# Altium schematic sheet PAGE2 - POWER, RTC, RPI.SchDoc (part 3 of 3)
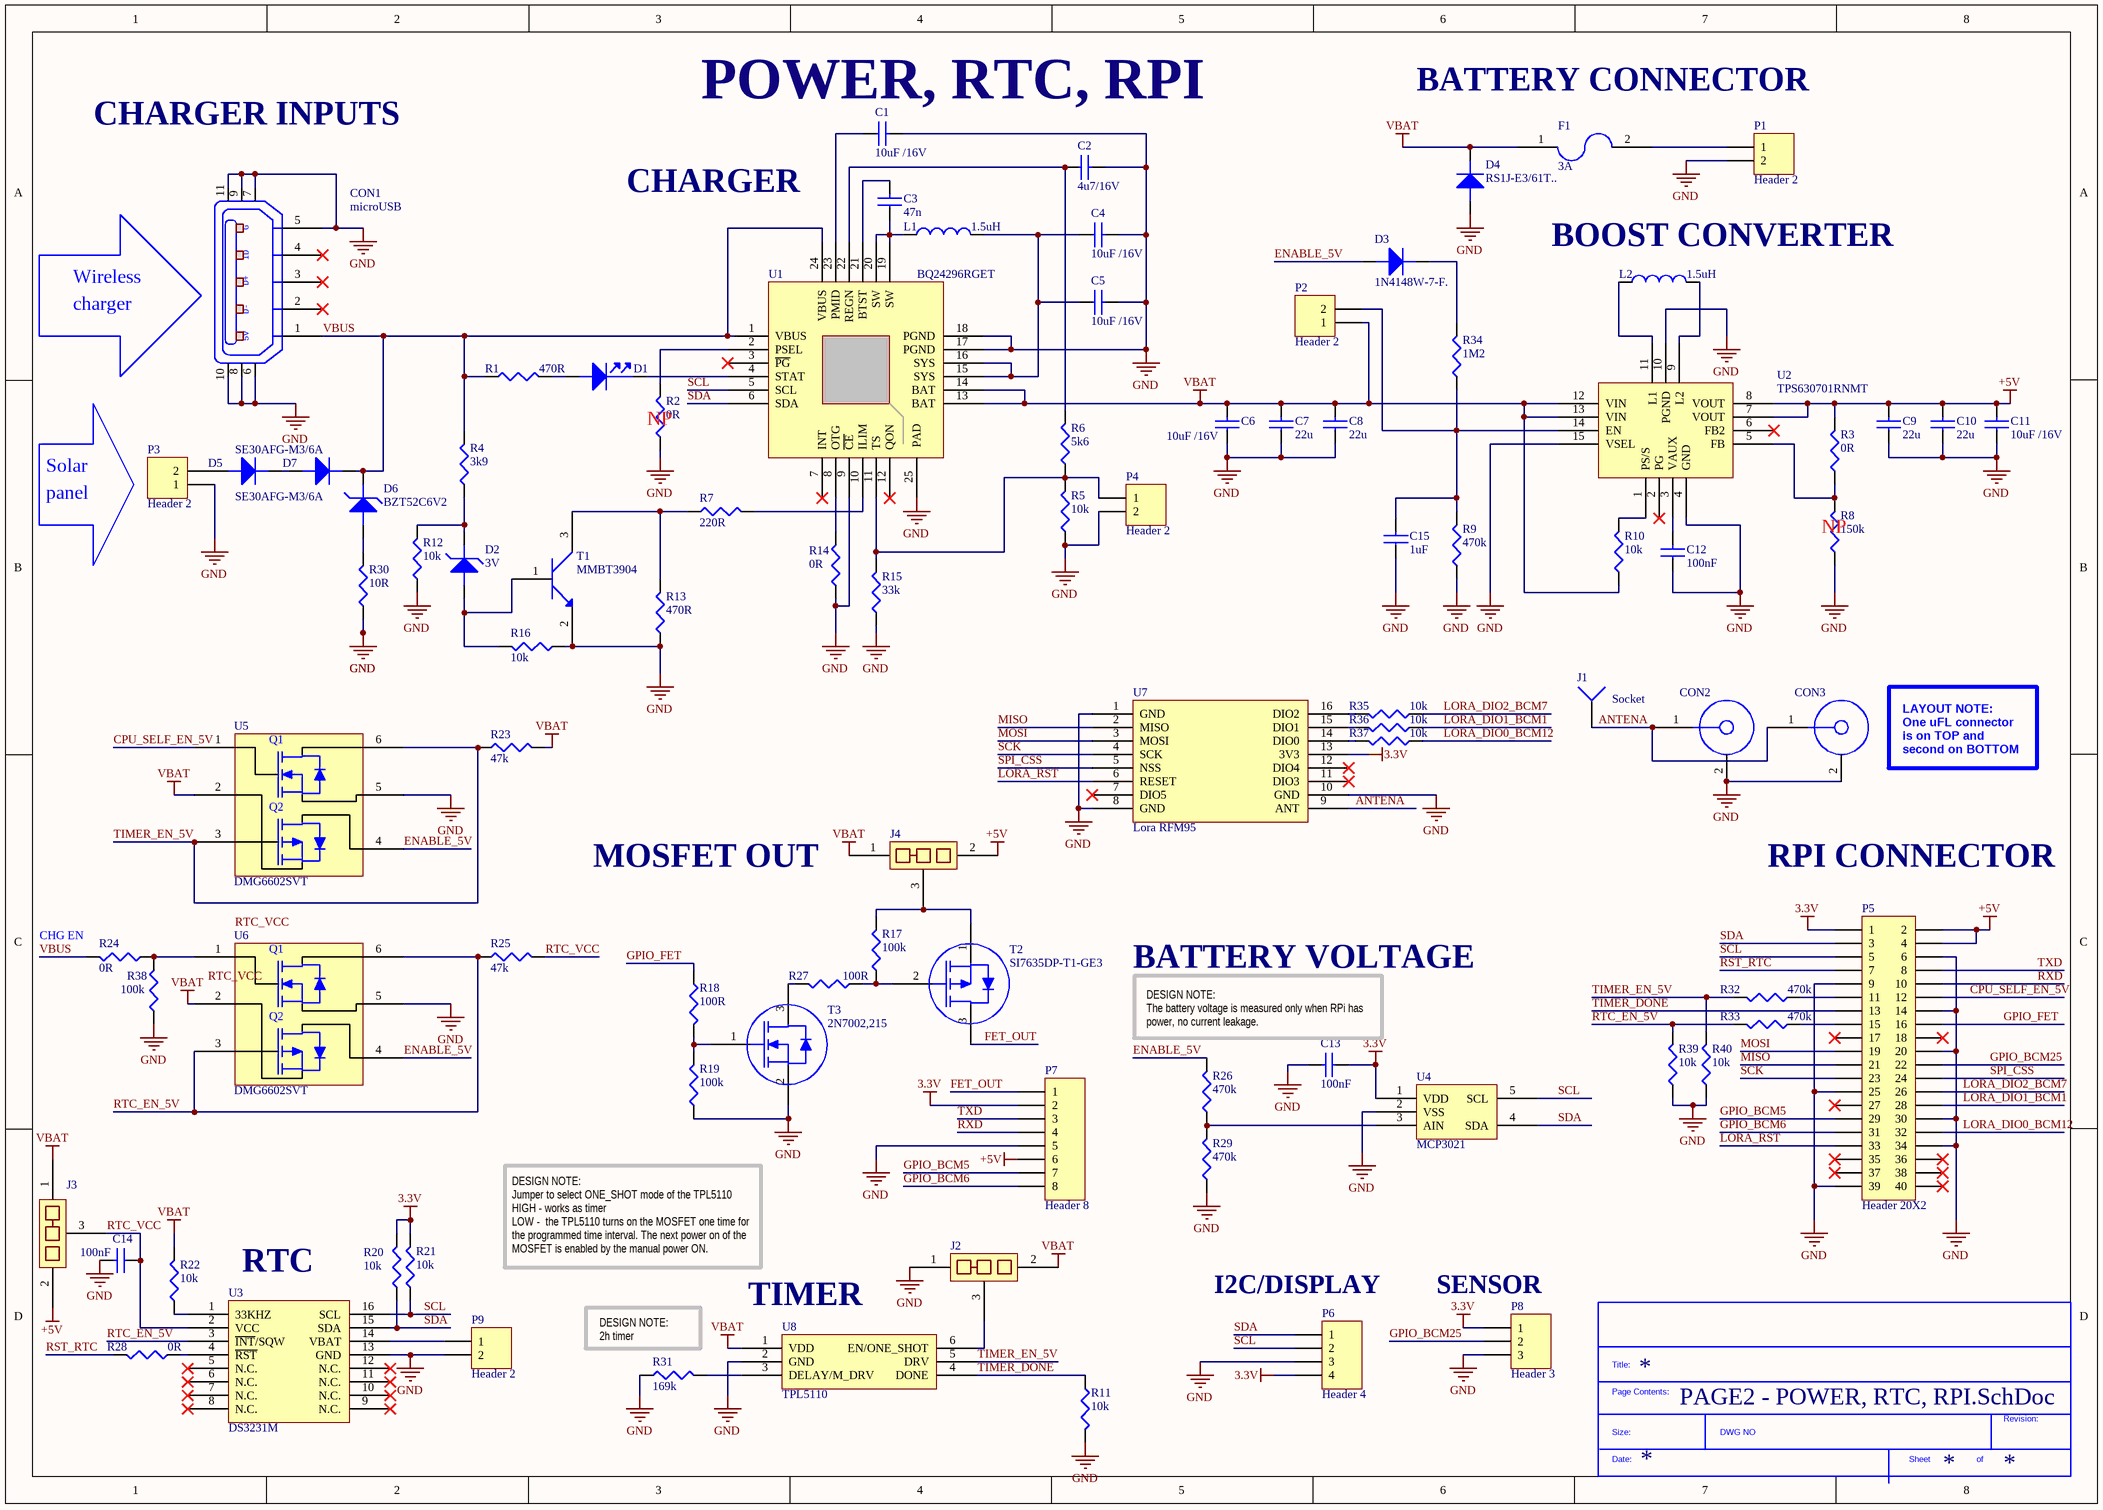
[diagram p2: PAGE2 - POWER, RTC, RPI.SchDoc]

## Library data of the parts (continued)
T2 = SI7635DP-T1-GE3: MOSFET P-CH 20V 40A PPAK SO-8; Manufacturer: Vishay Siliconix; Rds On Max: 4.9mR; Input Capacitance: 4.595nF; Nominal Vgs: -2.2V; Rise Time: 10ns; Max Power Dissipation: 54W; Gate to Source Voltage (Vgs): 16V; Fall Time: 13ns; Turn-Off Delay Time: 65ns; Number of Elements: 1; Power Dissipation: 5W; Element Configuration: Single; Drain to Source Breakdown Voltage: -20V; Turn-On Delay Time: 19ns; Supplier 1: Farnell; Manufacturer Part Number: SI7635DP-T1-GE3; Stock 1: 527; Pricing 1: 1=1.2, 25=0.99, 50=0.872, 100=0.754, 250=0.701, 500=0.648 (EUR); Mount: Surface Mount; Number of Pins: 8; Weight: 0.01787oz; Min Operating Temperature: -55°C; Max Operating Temperature: 150°C; Package Quantity: 1; Packaging: Tape and Reel; Continuous Drain Current (ID): 40A; Drain to Source Voltage (Vdss): 20V; Drain to Source Resistance: 4.9mR; Threshold Voltage: -2.2V; Number of Channels: 1; On-State Resistance: 4.9mR; Radiation Hardening: No; REACH SVHC: Unknown; Lead Free: Lead Free; ComponentLink1URL: https://datasheet.ciiva.com/13044/si7635dp-244446-13044984.pdf; ComponentLink1Description: https://datasheet.ciiva.com/13044/si7635dp-244446-13044984.pdf; ComponentLink2URL: https://datasheet.ciiva.com/7235/1750693-7235731.pdf; ComponentLink2Description: https://datasheet.ciiva.com/7235/1750693-7235731.pdf; ComponentLink3URL: https://datasheet.ciiva.com/6387/si7635dp-6387121.pdf; ComponentLink3Description: https://datasheet.ciiva.com/6387/si7635dp-6387121.pdf; ComponentLink4URL: https://datasheet.ciiva.com/16486/si7635dp-16486506.pdf; ComponentLink4Description: https://datasheet.ciiva.com/16486/si7635dp-16486506.pdf; ComponentLink5URL: https://datasheet.ciiva.com/11159/si7635dp-11159846.pdf; ComponentLink5Description: https://datasheet.ciiva.com/11159/si7635dp-11159846.pdf; ComponentLink6URL: https://datasheet.ciiva.com/6387/si7635dp-6387127.pdf; ComponentLink6Description: https://datasheet.ciiva.com/6387/si7635dp-6387127.pdf; Supplier Part Number 1: 1781668
T3 = 2N7002,215: NEXPERIA - 2N7002,215 - MOSFET,N CH, 60V,0.3A,SOT23; Transistor Polarity: N Channel; Continuous Drain Current Id: 300; Drain Source Voltage Vds: 60; On Resistance Rds(on): 2.8; Rds(on) Test Voltage Vgs: 10; Threshold Voltage Vgs: 2; Power Dissipation Pd: 830; Transistor Case Style: SOT-23; No. of Pins: 3; SVHC: No SVHC (17-Dec-2015); Device Marking: 12%; Junction Temperature Tj Max: 150; Junction Temperature Tj Min: -65; Pulse Current Idm: 1.2; Voltage Vgs Max: 30; Voltage Vgs th Max: 2.5V<!--FANDB--><div class="features-and-benefits-container"><div class="features-and-benefits-desc-container"><span class="features-and-benefits-container-desc">MOSFET Transistor, N Channel, 300 mA, 60 V, 2.8 ohm, 10 V, 2 V</span></div><div class="features-and-benefits-description"><span class="features-benefits-value">The 2N7002,215 is a N-channel enhancement mode Field Effect Transistor (FET) in surface mount plastic package uses Trench MOSFET technology. Suitable for logic level gate drive sources and high-speed line drivers.</span></div><div class="features-and-benefits-list"><ul class="features-and-benefits-list-list"><li class="features-and-benefits-list-item">Logic-level compatible</li><li class="features-and-benefits-list-item">Very fast switching</li></ul></div><div class="features-and-benefits-applications"><ul class="features-and-benefits-value"><li class="features-and-benefits-list-item">Industrial</li></ul></div></div>; Supplier 1: Farnell; Manufacturer: NEXPERIA; Manufacturer Part Number: 2N7002,215; RoHS: YES; Stock 1: 328913; Pricing 1: 5=0.145, 50=0.0518, 250=0.0477, 500=0.0365, 1500=0.0349 (GBP); Operating Temperature Max: 150; Product Range: -; Automotive Qualification Standard: -; MSL: MSL 1 - Unlimited; Current Id Max: 300; Junction to Case Thermal Resistance A: 150; Operating Temperature Min: -65; Packaging: Cut Tape; Storage Temperature Max: 150; Storage Temperature Min: -65; Termination Type: Surface Mount Device; Voltage Vds Typ: 60; Voltage Vgs Rds on Measurement: 10; ComponentLink1URL: http://www.nxp.com/packings/SOT23_215.html; ComponentLink1Description: http://www.nxp.com/packings/SOT23_215.html; ComponentLink2URL: https://assets.nexperia.com/documents/spice-model/2N7002.prm; ComponentLink2Description: https://assets.nexperia.com/documents/spice-model/2N7002.prm; ComponentLink3URL: http://www.farnell.com/datasheets/1499179.pdf; ComponentLink3Description: http://www.farnell.com/datasheets/1499179.pdf; ComponentLink4URL: http://www.farnell.com/datasheets/1936237.pdf; ComponentLink4Description: http://www.farnell.com/datasheets/1936237.pdf; Supplier Part Number 1: 1510761
U1 = BQ24296RGET: IC LI+ CHARGER PWR MGMT 24VQFN; Manufacturer: Texas Instruments; Battery Chemistry: Lithium-Ion/Polymer; Number of Cells: 1; Current - Charging: Constant - Programmable; Fault Protection: Over Current, Over Temperature, Over Voltage; Charge Current - Max: 3A; Battery Pack Voltage: 4.2V; Voltage - Supply (Max): 6.2V; Interface: I²C; Manufacturer Part Number: BQ24296RGET; RoHS: RoHS Compliant; Category: Integrated Circuits (ICs); Packaging: Cut Tape (CT); Part Status: Active; Programmable Features: -; Operating Temperature: -40°C ~ 85°C (TA); Package / Case: 24-VFQFN Exposed Pad; Supplier Device Package: 24-VQFN (4x4); ComponentLink1URL: http://www.ti.com/lit/ds/symlink/bq24296.pdf; ComponentLink1Description: http://www.ti.com/lit/ds/symlink/bq24296.pdf; Supplier 1: Farnell; Supplier Part Number 1: 2373541
U2 = TPS630701RNMT: TEXAS INSTRUMENTS - TPS630701RNMT - DC/DC CONV, BUCK-BOOST, 2.4MHZ, VQFN-15; Input Voltage Min: 2; Input Voltage Max: 16; DC / DC Converter IC Case: VQFN; No. of Pins: 15; Output Voltage Nom.: 5; Switching Frequency: 2.4; SVHC: No SVHC (17-Dec-2015; Supplier 1: Farnell; Manufacturer: TEXAS INSTRUMENTS; Manufacturer Part Number: TPS630701RNMT; RoHS: YES; Stock 1: 456; Pricing 1: 1=2.23, 10=1.87, 100=1.7, 250=1.56, 500=1.47, 1000=1.21 (GBP); Topology: Buck-Boost; Output Current: 2; Operating Temperature Max: 125; Packaging: Cut Tape; Product Range: -; Automotive Qualification Standard: -; MSL: MSL 1 - Unlimited; ComponentLink1URL: http://www.ti.com/general/docs/lit/getliterature.tsp?genericPartNumber=TPS63070&fileType=pdf; ComponentLink1Description: http://www.ti.com/general/docs/lit/getliterature.tsp?genericPartNumber=TPS63070&fileType=pdf; Supplier Part Number 1: 2643432
U3 = DS3231M+TRL: MAXIM INTEGRATED PRODUCTS - DS3231M+TRL - RTC, I2C, WSOIC-16; Date Format: Day; Clock Format: HH; Clock IC Type: Alarm RTC; Supply Voltage Min: 2.3; Supply Voltage Max: 5.5; Clock IC Case Style: WSOIC; No. of Pins: 16; IC Interface Type: I2; Supplier 1: Farnell; Manufacturer: MAXIM INTEGRATED PRODUCTS; Manufacturer Part Number: DS3231M+TRL; RoHS: YES; Stock 1: 842; Pricing 1: 1=7.35, 10=6.42, 25=5.13, 50=4.88, 100=4.48, 250=4.1, 1000=3.11 (GBP); Operating Temperature Min: -40; Operating Temperature Max: 85; Packaging: Cut Tape; Product Range: -; Automotive Qualification Standard: -; MSL: MSL 3 - 168 hours<!--FANDB--><div class="features-and-benefits-container"><div class="features-and-benefits-description"><span class="features-benefits-value">The DS3231M+TRL is a ±5ppm, I2C real time clock (RTC) in 16 pin WSOIC package. The low cost, extremely accurate, I2C RTC device incorporates a battery input and maintains accurate timekeeping when main power to the device is interrupted. The integration of microelectromechanical systems (MEMS) resonator enhances long-term accuracy of the device and reduces the piece part count in manufacturing line. The RTC maintains seconds, minutes, hours, day, date, month and year information. The date at the end of the month is automatically adjusted for months with fewer than 31 days including corrections for leap year. The clock operates in either the 24hour or 12hour format with an AM/PM indicator. A precision temperature compensated voltage reference and comparator circuit monitors the status of VCC to detect power failures to provide a reset output and to automatically switch to backup supply when necessary. The RST pin is monitored as a pushbutton input for generating a microprocessor reset.</span></div><div class="features-and-benefits-list"><ul class="features-and-benefits-list-list"><li class="features-and-benefits-list-item">Supply voltage range is 2.3V to 5.5V</li><li class="features-and-benefits-list-item">Operating temperature range from -40°C to 85°C</li><li class="features-and-benefits-list-item">Leap year compensation up to year 2100</li><li class="features-and-benefits-list-item">Footprint and functionally compatible to DS3231</li><li class="features-and-benefits-list-item">Two programmable time of day alarms</li><li class="features-and-benefits-list-item">1Hz and 32.768KHz outputs</li><li class="features-and-benefits-list-item">Digital temp sensor with ±3°C accuracy</li><li class="features-and-benefits-list-item">Address and data are transferred serially through an I2; ComponentLink1URL: http://www.farnell.com/datasheets/2001796.pdf; ComponentLink1Description: http://www.farnell.com/datasheets/2001796.pdf; Supplier Part Number 1: 2515485
U4 = MCP3021A5T-E/OT: MICROCHIP - MCP3021A5T-E/OT - 10BIT ADC, I2C, 1CH, SMD, SOT-23A-5; Resolution (Bits): 10; Sampling Rate: 22.3; Supply Voltage Type: Single; Supply Voltage Min: 2.7; Supply Voltage Max: 5.5; ADC / DAC Case Style: SOT-23; No. of Pins: 5; Input Channel Type: Single Ended; Data Interface: I2; Product Range: Single 10; Automotive Qualification Standard: AEC-Q100; SVHC: No SVHC (17-Dec-2015); Base Number: 3021; Conversion Time: 45.4; Linearity Error ADC / DAC +: 1; Supply Current: 175; Supply Voltage Range: 2.7V to 5.5; Voltage Regulator Type: ADC<!--FANDB--><div class="features-and-benefits-container"><div class="features-and-benefits-description"><span class="features-benefits-value">The MCP3021A5T-E/OT is a 10-bit low power Analogue-to-digital Converter (ADC). This device provides one/single-ended input with very low power consumption. The MCP3021 provides a low maximum conversion current and standby current of 250µA and 1µA respectively. Communication to the MCP3021 is performed using a 2; Supplier 1: Farnell; Manufacturer: MICROCHIP; Manufacturer Part Number: MCP3021A5T-E/OT; RoHS: YES; Stock 1: 8474; Pricing 1: 1=0.926, 10=0.855, 25=0.759, 50=0.716, 100=0.648 (GBP); Operating Temperature Min: -40; Operating Temperature Max: 125; Packaging: Cut Tape; MSL: MSL 1 - Unlimited; IC Case Style: SOT-23; Linearity Error ADC / DAC -: 1; No. of Bits: 10; No. of Channels: 1; Operating Temperature Range: -40°C to +125; Supply Voltage Range - Analogue: 2.7V to 5.5; Termination Type: Surface Mount Device; ComponentLink1URL: http://www.farnell.com/datasheets/2124926.pdf; ComponentLink1Description: http://www.farnell.com/datasheets/2124926.pdf; ComponentLink2URL: http://www.farnell.com/cad/1545509.zip; ComponentLink2Description: http://www.farnell.com/cad/1545509.zip; ComponentLink3URL: http://www.farnell.com/datasheets/2338016.pdf; ComponentLink3Description: http://www.farnell.com/datasheets/2338016.pdf; Supplier Part Number 1: 1332097
U5 U6 = DMG6602SVT: DIODES INC. - DMG6602SVT - MOSFET, NP CH, , 30V, 3.4, ATSOT23; Transistor Polarity: N and P Channel; Continuous Drain Current Id: 3.4; Drain Source Voltage Vds: 30; On Resistance Rds(on): 0.038; Rds(on) Test Voltage Vgs: 10; Threshold Voltage Vgs: 1; Power Dissipation Pd: 1.12; Transistor Case Style: TSOT-26; No. of Pins: 6; SVHC: No SVHC (17-Dec-2015); Continuous Drain Current Id, P Channel: -2.8; Drain Source Voltage Vds, P Channel: -30; Module Configuration: Dual; On Resistance Rds(on), P Channel: 0.073; Supplier 1: Farnell; Manufacturer: DIODES INC.; Manufacturer Part Number: DMG6602SVT; RoHS: YES; Stock 1: 4881; Pricing 1: 1=0.363, 25=0.339, 100=0.169, 250=0.166, 500=0.108, 1000=0.0809, 2000=0.0793, 6000=0.0777 (GBP); Operating Temperature Max: 150; Product Range: -; Automotive Qualification Standard: -; MSL: -; Continuous Drain Current Id, N Channel: 3.4; Drain Source Voltage Vds, N Channel: 30; On Resistance Rds(on), N Channel: 0.038; Operating Temperature Min: -55; Operating Temperature Range: -55°C to +150°C<!--FANDB--><div class="features-and-benefits-container"><div class="features-and-benefits-description"><span class="features-benefits-value">The DMG6602SVT from Diode Inc is a surface mount complementary pair enhancement mode MOSFET in TSOT-26 package. This MOSFET features low input capacitance, fast switching speed and low input/output leakage, designed to minimize the onstate resistance and maintain superior switching performance, making it ideal for high efficiency power management applications and backlighting.</span></div><div class="features-and-benefits-list"><ul class="features-and-benefits-list-list"><li class="features-and-benefits-list-item">Automotive grade AEC-Q101 qualified</li><li class="features-and-benefits-list-item">UL recognized</li><li class="features-and-benefits-list-item">Drain to source voltage (Vds) of 30V</li><li class="features-and-benefits-list-item">Gate to source voltage (Vgs) of ±20V</li><li class="features-and-benefits-list-item">Continuous drain current of 3.4A</li><li class="features-and-benefits-list-item">Power dissipation (Pd) of 1.27W</li><li class="features-and-benefits-list-item">Operating temperature range -55°C to 150°C</li><li class="features-and-benefits-list-item">Low on state resistance of 38mohm at Vgs of 10; ComponentLink1URL: http://www.farnell.com/datasheets/1915929.pdf; ComponentLink1Description: http://www.farnell.com/datasheets/1915929.pdf; Supplier Part Number 1: 2061522
U7 = Lora RFM95 868M: RFM95 ULTRA-LONG RANGE TRANSCEIV; Manufacturer: Seeed Technology Co., Ltd; Manufacturer Part Number: 109990166; RF Family/Standard: General ISM < 1GHz; Protocol: LoRa™; Modulation: FSK, GFSK, GMSK, MSK, OOK; Frequency: 868MHz; Data Rate: 300kbps; Power - Output: 20dBm; Sensitivity: -148dBm; Serial Interfaces: SPI; Voltage - Supply: 1.8 V ~ 3.7 V; Current - Receiving: 12.1mA; Current - Transmitting: 120mA; Supplier 1: Digi-Key; RoHS: Not Applicable; Category: RF/IF and RFID; Stock 1: 211; Pricing 1: 1=7.09 (USD); Packaging: Bulk; Part Status: Active; Antenna Type: -; Memory Size: -; Mounting Type: Surface Mount; Operating Temperature: -20°C ~ 70°C; Package / Case: Module; ComponentLink1URL: https://github.com/SeeedDocument/RFM95-98_LoRa_Module/blob/master/RFM95_96_97_98_DataSheet.pdf; ComponentLink1Description: https://github.com/SeeedDocument/RFM95-98_LoRa_Module/blob/master/RFM95_96_97_98_DataSheet.pdf; Supplier Part Number 1: 1597-1488-ND
U8 = TPL5110DDCT: TEXAS INSTRUMENTS - TPL5110DDCT - NANO TIMER, SINGLE, 5.5V, SOT-23-6; Supply Voltage Min: 1.8; Supply Voltage Max: 5.5; Digital IC Case: SOT-23; No. of Pins: 6; SVHC: No SVHC (15-Jun-2015)<!--FANDB--><div class="features-and-benefits-container"><div class="features-and-benefits-description"><span class="features-benefits-value">The TPL5110DDCT is an Ultralow Power Timer with MOS driver and MOSFET power ON ideal for power gating in duty cycled or battery powered applications. Consuming only 35nA, the TPL5110 can enable the power supply line and drastically reduce the overall system stand by current during the sleep time. Such power savings enable the use of significantly smaller batteries making it well suited for energy harvesting or wireless sensor applications. The TPL5110 provides selectable timing intervals from 100ms to 7200s and is designed for power gating applications. In addition, the TPL5110 has an unique one-shot feature where the timer will only power the MOSFET for one cycle.</span></div><div class="features-and-benefits-list"><ul class="features-and-benefits-list-list"><li class="features-and-benefits-list-item">35nA Typical current consumption at 2.5V</li><li class="features-and-benefits-list-item">100ms to 7200s Selectable time intervals</li><li class="features-and-benefits-list-item">1; Supplier 1: Farnell; Manufacturer: TEXAS INSTRUMENTS; Manufacturer Part Number: TPL5110DDCT; RoHS: YES; Stock 1: 1212; Pricing 1: 1=1, 10=0.703, 100=0.569, 250=0.528, 500=0.474, 1000=0.325 (GBP); Frequency: -; Operating Temperature Min: -40; Operating Temperature Max: 105; Packaging: Each; Product Range: -; MSL: MSL 1 - Unlimited; ComponentLink1URL: http://www.ti.com/general/docs/lit/getliterature.tsp?genericPartNumber=TPL5110&amp;&amp;fileType=pdf; ComponentLink1Description: http://www.ti.com/general/docs/lit/getliterature.tsp?genericPartNumber=TPL5110&amp;&amp;fileType=pdf; ComponentLink2URL: http://www.farnell.com/datasheets/2037314.pdf; ComponentLink2Description: http://www.farnell.com/datasheets/2037314.pdf; Supplier Part Number 1: 2471145
J1 = Socket: LatestRevisionDate: 17-Jul-2002; LatestRevisionNote: Re-released for DXP Platform.; Publisher: Altium Limited